# EAGLE design board (EAGLE 9.6.2)
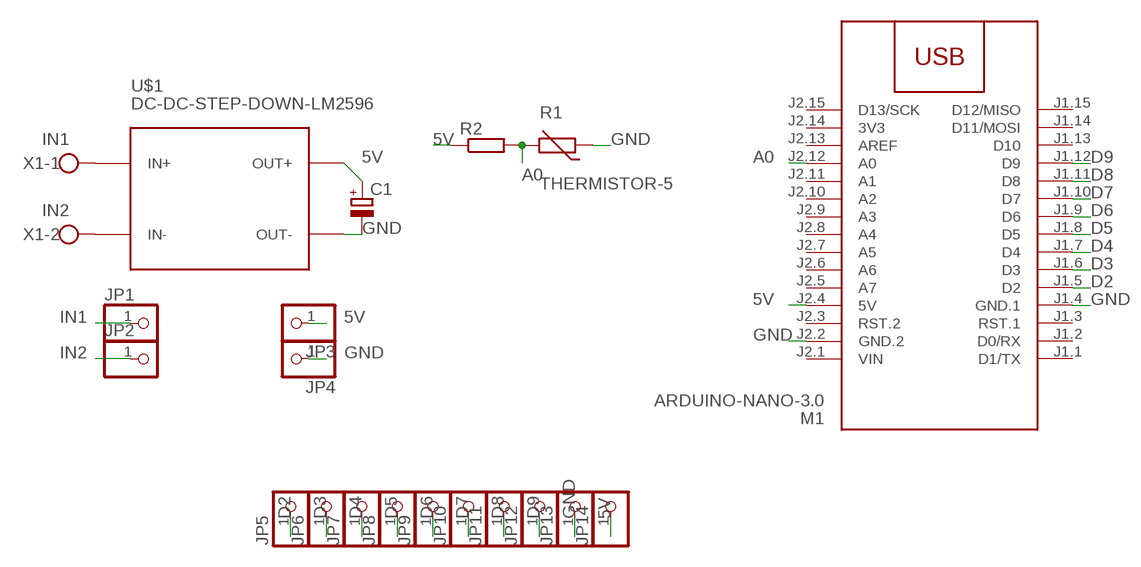
[diagram p0: schematic, sheet 1]

## Parts
C1  CPOL-EUB45181A  [B45181A]
JP1  PINHD-1X1  [1X01]
JP2  PINHD-1X1  [1X01]
JP3  PINHD-1X1  [1X01]
JP4  PINHD-1X1  [1X01]
JP5  PINHD-1X1  [1X01]
JP6  PINHD-1X1  [1X01]
JP7  PINHD-1X1  [1X01]
JP8  PINHD-1X1  [1X01]
JP9  PINHD-1X1  [1X01]
JP10  PINHD-1X1  [1X01]
JP11  PINHD-1X1  [1X01]
JP12  PINHD-1X1  [1X01]
JP13  PINHD-1X1  [1X01]
JP14  PINHD-1X1  [1X01]
M1  ARDUINO-NANO-3.0  [ARDUINO-NANO-3.0]
R1  THERMISTOR-5  [R-5]
R2  R-EU_0207/10  [0207/10]
U$1  DC-DC-STEP-DOWN-LM2596  [DC-DC-STEP-DOWN-LM2596]
X1  W237-102  [W237-102]

## Nets
5V: C1.+ JP3.1 JP14.1 M1.J2.4(5V) R2.1 U$1.OUT+
A0: M1.J2.12(A0) R1.2 R2.2
D2: JP5.1 M1.J1.5(D2)
D3: JP6.1 M1.J1.6(D3)
D4: JP7.1 M1.J1.7(D4)
D5: JP8.1 M1.J1.8(D5)
D6: JP9.1 M1.J1.9(D6)
D7: JP10.1 M1.J1.10(D7)
D8: JP11.1 M1.J1.11(D8)
D9: JP12.1 M1.J1.12(D9)
GND: C1.- JP4.1 JP13.1 M1.J1.4(GND.1) M1.J2.2(GND.2) R1.1 U$1.OUT-
IN1: JP1.1 U$1.IN+ X1.1
IN2: JP2.1 U$1.IN- X1.2
Unconnected: M1.J1.1(D1/TX) M1.J1.2(D0/RX) M1.J1.3(RST.1) M1.J1.13(D10) M1.J1.14(D11/MOSI) M1.J1.15(D12/MISO) M1.J2.3(RST.2) M1.J2.5(A7) M1.J2.6(A6) M1.J2.7(A5) M1.J2.8(A4) M1.J2.9(A3) M1.J2.10(A2) M1.J2.11(A1) M1.J2.13(AREF) M1.J2.15(D13/SCK)

## Power pins joined to a net without a drawn wire
3V3: M1.J2.14(3V3)
VIN: M1.J2.1(VIN)

## Library data of the parts
C1 = rcl:CPOL-EU: POLARIZED CAPACITOR, European symbol; SPICEPREFIX: C
JP1-JP14 = pinhead:PINHD-1X1: PIN HEADER
M1 = diy-modules:ARDUINO-NANO-3.0: Arduino Nano 3.0 and compatible devices More details available here: https://www.arduino.cc/en/Main/ArduinoBoardNano Click here to find device on ebay.com <http://www.ebay.com/sch/arduino+nano>
R1 = varistor:THERMISTOR: THERMISTOR
R2 = rcl:R-EU_: RESISTOR, European symbol; SPICEPREFIX: R
U$1 = diy-modules:DC-DC-STEP-DOWN-LM2596: DC/DC Step-Down Regulator based on LM2596-ADJ chip LM2596 datasheet available here: http://www.ti.com/lit/ds/symlink/lm2596.pdf Click here to find device on ebay.com <http://www.ebay.com/sch/lm2596+power+regulator>
X1 = con-wago-500:W237-102: WAGO SCREW CLAMP; MPN: 237-102; OC_FARNELL: unknown; OC_NEWARK: 70K9898

## Board
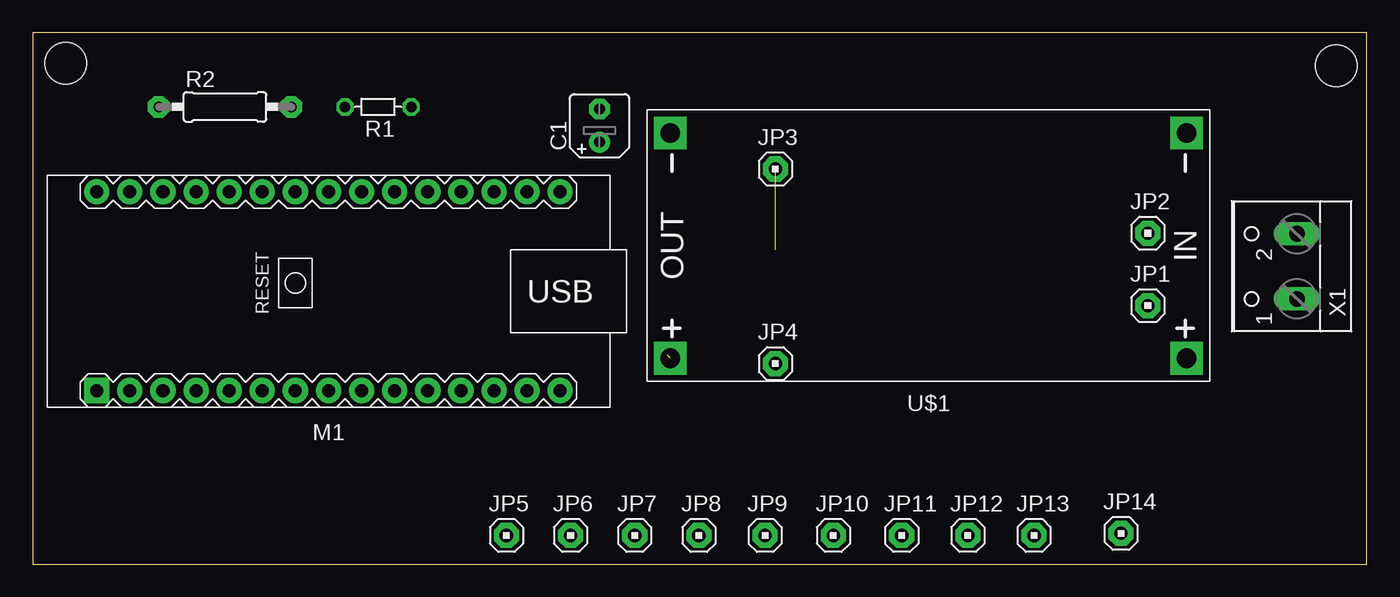
[diagram p1: board, top side]
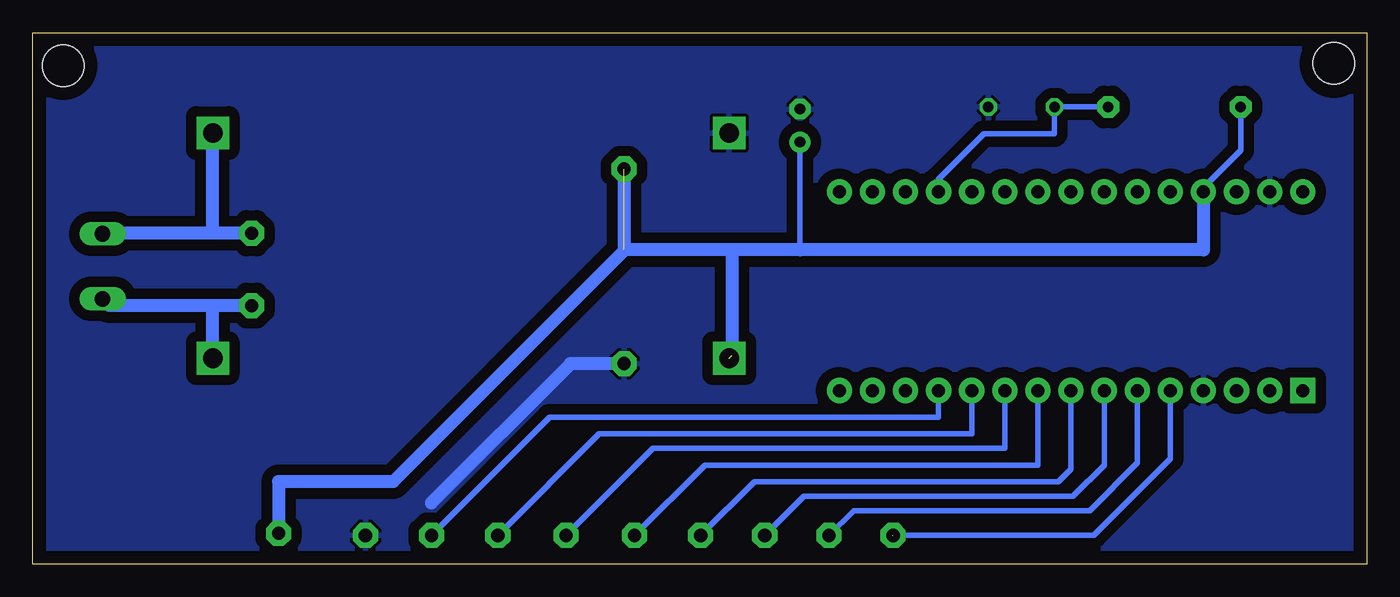
[diagram p2: board, bottom side, seen from below]

Size 102.37 x 40.79 mm. Coordinates in mm from the lower left corner, seen from the top.
Outline: 0,0 102.37,0 102.37,40.79 0,40.79 0,0
Copper layers (1*16): Top 0.035mm / dielectric 1.5mm / Bottom 0.035mm
Design rules "default": minimum track width 6mil, minimum drill 0.35mm, track to track 6mil, track to pad 6mil, pad to pad 6mil, via to via 6mil, smd to smd 6mil, copper to edge 40mil, drill to drill 6mil, minimum pad ring 10mil, minimum via ring 8mil, stop-mask expansion 4mil, vias tented up to drill 0mil, thermal gap 10mil
Holes 3.2 mm at 2.54,38.42 100.01,38.26

### Footprints (pad centres in the part's own frame; a part is rotated, then mirrored left to right if it is on the bottom)
B45181A = drill 0.813 pad 1.6: + -1.27,0 | drill 0.813 pad 1.6 octagon: - 1.27,0
1X01 = drill 1.016 pad 1.93 octagon: 1 0,0
ARDUINO-NANO-3.0 = drill 1 pad 1.93 square: J1.1 17.78,7.62 | drill 1 pad 1.93: J1.2 15.24,7.62; J1.3 12.7,7.62; J1.4 10.16,7.62; J1.5 7.62,7.62; J1.6 5.08,7.62; J1.7 2.54,7.62; J1.8 0,7.62; J1.9 -2.54,7.62; J1.10 -5.08,7.62; J1.11 -7.62,7.62; J1.12 -10.16,7.62; J1.13 -12.7,7.62; J1.14 -15.24,7.62; J1.15 -17.78,7.62; J2.1 17.78,-7.62; J2.2 15.24,-7.62; J2.3 12.7,-7.62; J2.4 10.16,-7.62; J2.5 7.62,-7.62; J2.6 5.08,-7.62; J2.7 2.54,-7.62; J2.8 0,-7.62; J2.9 -2.54,-7.62; J2.10 -5.08,-7.62; J2.11 -7.62,-7.62; J2.12 -10.16,-7.62; J2.13 -12.7,-7.62; J2.14 -15.24,-7.62; J2.15 -17.78,-7.62
R-5 = drill 0.813 octagon: 1 -2.54,0; 2 2.54,0
0207/10 = drill 0.8 pad 1.676 octagon: 1 -5.08,0; 2 5.08,0
DC-DC-STEP-DOWN-LM2596 = drill 1.5 pad 2.5 square: IN+ -19.812,8.636; IN- -19.812,-8.636; OUT+ 19.812,8.636; OUT- 19.812,-8.636
W237-102 = drill 1.194 long: 1 -2.5,-1.27; 2 2.5,-1.27

### Placement (x,y rotation side)
C1  43.5,33.66 90 top
JP1  85.57,19.84 0 top
JP2  85.57,25.4 0 top
JP3  56.99,30.32 0 top
JP4  56.99,15.4 0 top
JP5  36.35,2.22 0 top
JP6  41.27,2.22 0 top
JP7  46.2,2.22 0 top
JP8  51.12,2.22 0 top
JP9  56.2,2.22 0 top
JP10  61.44,2.22 0 top
JP11  66.67,2.22 0 top
JP12  71.75,2.22 0 top
JP13  76.83,2.22 0 top
JP14  83.5,2.38 0 top
M1  22.7,20.95 180 top
R1  26.51,35.08 180 top
R2  14.76,35.08 0 top
U$1  68.74,24.45 180 top
X1  95.73,22.86 90 top

### Tracks (layer width: path | path; a pad name or v marks a point on that pad's centre or on a via)
5V  (2 unrouted)
  Bottom 0.406: R2.1 9.68,31.75 12.54,28.89 M1.J2.4 | C1.+ 43.5,24.13
  Bottom 1.016: 48.7,24.13 43.5,24.13 12.54,24.13 M1.J2.4 | 48.7,24.13 48.7,16.04 | 48.7,24.13 56.99,24.13 | JP3.1 56.99,24.07 74.71,6.35 83.5,6.35 JP14.1
A0
  Bottom 0.406: R2.2 R1.2 23.97,33.02 29.37,33.02 32.86,29.53 M1.J2.12
D2  (1 unrouted)
  Bottom 0.406: M1.J1.5 15.08,8.1 20.95,2.22 36.4,2.22
D3
  Bottom 0.406: M1.J1.6 17.62,7.78 21.27,4.13 39.37,4.13 JP6.1
D4
  Bottom 0.406: M1.J1.7 20.16,7.62 22.54,5.24 43.18,5.24 JP7.1
D5
  Bottom 0.406: M1.J1.8 22.7,7.3 23.65,6.35 46.99,6.35 JP8.1
D6
  Bottom 0.406: M1.J1.9 25.24,7.62 50.8,7.62 JP9.1
D7
  Bottom 0.406: M1.J1.10 27.78,8.89 54.77,8.89 JP10.1
D8
  Bottom 0.406: M1.J1.11 30.32,10 58.9,10 JP11.1
D9
  Bottom 0.406: M1.J1.12 32.86,11.27 62.71,11.27 JP12.1
GND
  Bottom 1.016: JP4.1 61.12,15.4 71.8,4.72
  pour Bottom (isolate 0.813): 0,44.61 102.71,44.61 102.71,-0.48 0,-0.48
IN1
  Bottom 1.016: JP1.1 88.55,19.84 | 88.55,19.84 96.48,19.84 X1.1 | U$1.IN+ 88.55,19.84
IN2
  Bottom 1.016: JP2.1 88.58,25.4 | 88.58,25.4 96.96,25.4 X1.2 | U$1.IN- 88.58,33.05 88.58,25.4